# Altium schematic sheet Sheet.SchDoc
size A3
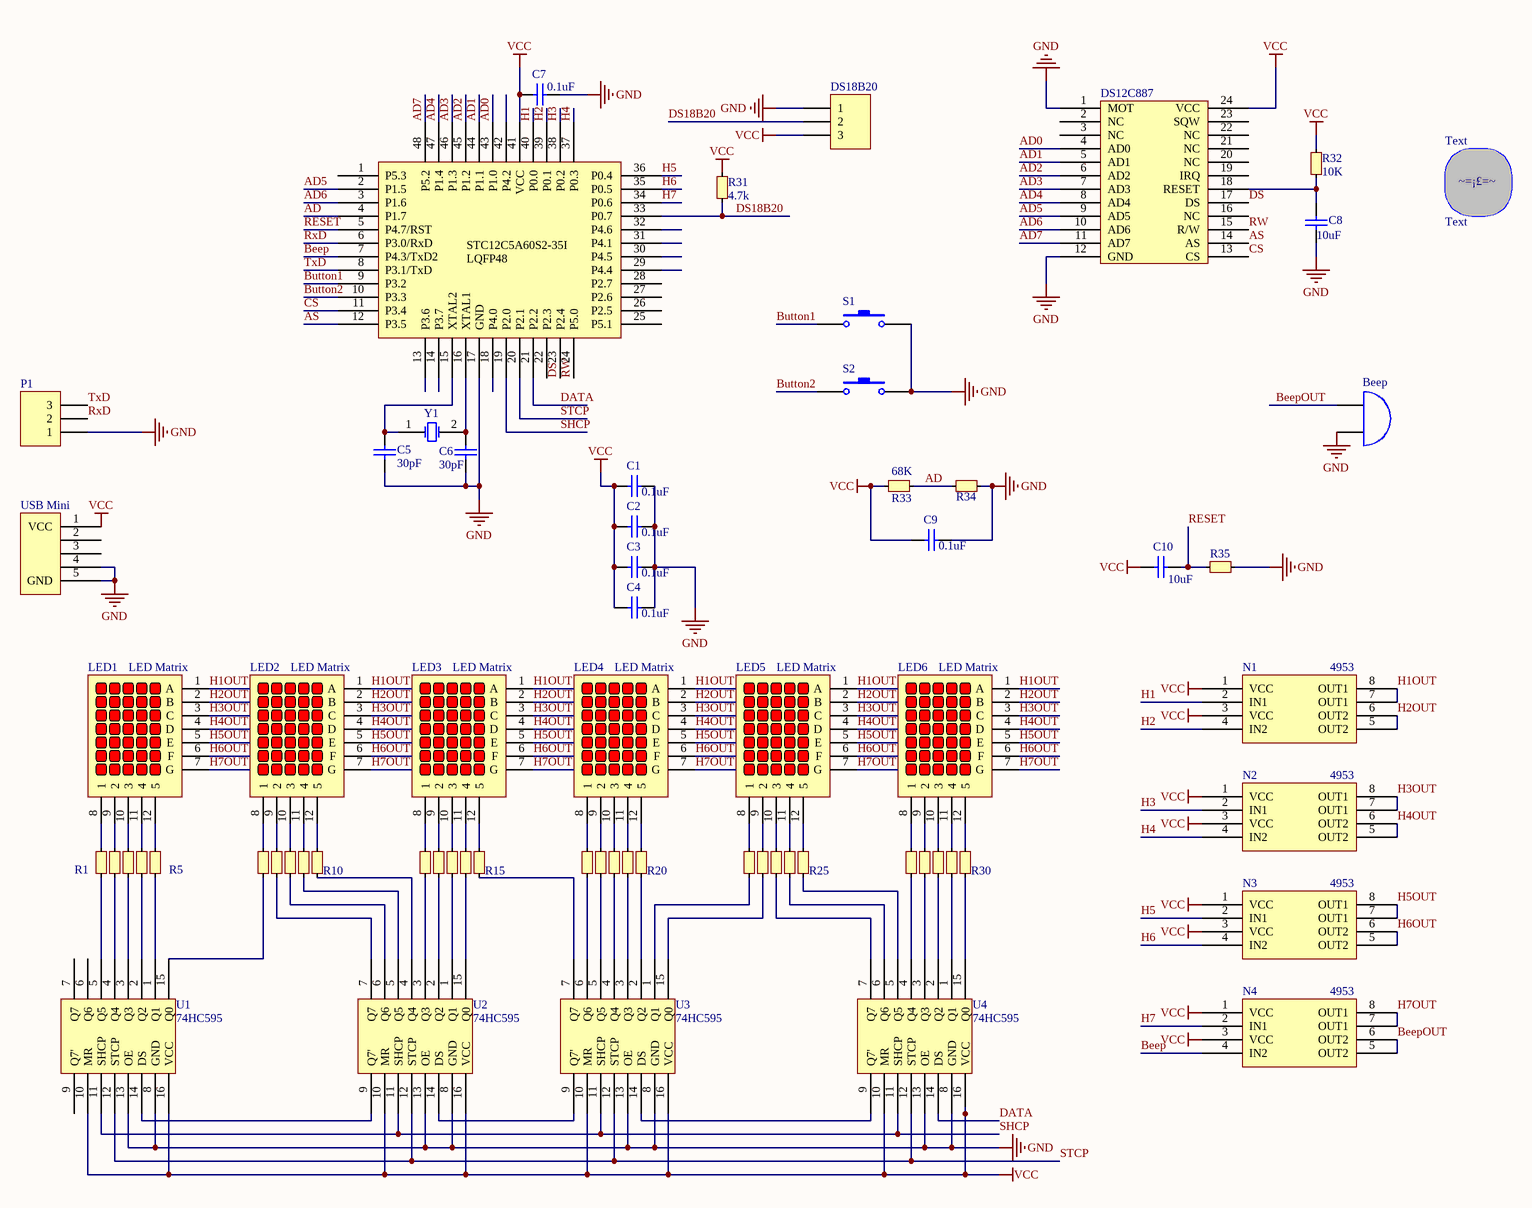
[diagram p0: Sheet.SchDoc]

## Parts
Beep  Bell  [Beep]  (value not drawn)
C1  value 0.1uF  [0805 - duplicate]  (hidden comment: Cap)
C2  value 0.1uF  [0805 - duplicate]  (hidden comment: Cap)
C3  value 0.1uF  [0805 - duplicate]  (hidden comment: Cap)
C4  value 0.1uF  [0805 - duplicate]  (hidden comment: Cap)
C5  value 30pF  [0805 - duplicate]  (hidden comment: Cap)
C6  value 30pF  [0805 - duplicate]  (hidden comment: Cap)
C7  value 0.1uF  [0805 - duplicate]  (hidden comment: Cap)
C8  value 10uF  [0805 - duplicate]  (hidden comment: Cap)
C9  value 0.1uF  [0805 - duplicate]  (hidden comment: Cap)
C10  value 10uF  [0805 - duplicate]  (hidden comment: Cap)
DS12C887  DS12C887  [Timer]  (value not drawn)
DS18B20  Header 3  [TO-92]  (value not drawn)
LED1  LED Matrix  [LED-Matrix 5*7]
LED2  LED Matrix  [LED-Matrix 5*7]
LED3  LED Matrix  [LED-Matrix 5*7]
LED4  LED Matrix  [LED-Matrix 5*7]
LED5  LED Matrix  [LED-Matrix 5*7]
LED6  LED Matrix  [LED-Matrix 5*7]
MCU  STC12C5A60S2-35I-LQFP48  [MCU]  (value not drawn)
N1  4953  [SO8_L]
N2  4953  [SO8_L]
N3  4953  [SO8_L]
N4  4953  [SO8_L]
P1  Header 3  [HDR1X3]  (value not drawn)
R1  Res  [0805]  (value not drawn)
R2  Res  [0805]  (value not drawn)
R3  Res  [0805]  (value not drawn)
R4  Res  [0805]  (value not drawn)
R5  Res  [0805]  (value not drawn)
R6  Res  [0805]  (value not drawn)
R7  Res  [0805]  (value not drawn)
R8  Res  [0805]  (value not drawn)
R9  Res  [0805]  (value not drawn)
R10  Res  [0805]  (value not drawn)
R11  Res  [0805]  (value not drawn)
R12  Res  [0805]  (value not drawn)
R13  Res  [0805]  (value not drawn)
R14  Res  [0805]  (value not drawn)
R15  Res  [0805]  (value not drawn)
R16  Res  [0805]  (value not drawn)
R17  Res  [0805]  (value not drawn)
R18  Res  [0805]  (value not drawn)
R19  Res  [0805]  (value not drawn)
R20  Res  [0805]  (value not drawn)
R21  Res  [0805]  (value not drawn)
R22  Res  [0805]  (value not drawn)
R23  Res  [0805]  (value not drawn)
R24  Res  [0805]  (value not drawn)
R25  Res  [0805]  (value not drawn)
R26  Res  [0805]  (value not drawn)
R27  Res  [0805]  (value not drawn)
R28  Res  [0805]  (value not drawn)
R29  Res  [0805]  (value not drawn)
R30  Res  [0805]  (value not drawn)
R31  4.7k  [0805]
R32  10K  [0805]
R33  68K  [0805]
R34  Res  [R38]  (value not drawn)
R35  Res  [0805]  (value not drawn)
S1  SW-PB  [Button]  (value not drawn)
S2  SW-PB  [Button]  (value not drawn)
Text  Text  [TUSIJI_8]
U1  74HC595  [SO-16_L]
U2  74HC595  [SO-16_L]
U3  74HC595  [SO-16_L]
U4  74HC595  [SO-16_L]
USB_Mini  (no value)  [Micro_USB]
Y1  XTAL  [5023]  (value not drawn)

## Nets
GND: Beep.2(B) C1.2 C2.2 C3.2 C4.2 C5.1 C6.1 C7.2 C8.1 C9.2 DS12C887.1(MOT) DS12C887.12(GND) DS18B20.1 MCU.17(GND) P1.1 R34.1 R35.1 S1.2 S2.2 U1.8(GND) U1.13(OE) U2.8(GND) U2.13(OE) U3.8(GND) U3.13(OE) U4.8(GND) U4.13(OE) USB_Mini.4 USB_Mini.5(GND)
VCC: C1.1 C2.1 C3.1 C4.1 C7.1 C9.1 C10.1 DS12C887.24(VCC) DS18B20.3 MCU.41(VCC) N1.1(VCC) N1.3(VCC) N2.1(VCC) N2.3(VCC) N3.1(VCC) N3.3(VCC) N4.1(VCC) N4.3(VCC) R31.1 R32.1 R33.0 U1.10(MR) U1.16(VCC) U2.10(MR) U2.16(VCC) U3.10(MR) U3.16(VCC) U4.10(MR) U4.16(VCC) USB_Mini.1(VCC)
AD: MCU.4(P1.7) R33.1 R34.0
AD0: DS12C887.4(AD0) MCU.43(P1.0)
AD1: DS12C887.5(AD1) MCU.44(P1.1)
AD2: DS12C887.6(AD2) MCU.45(P1.2)
AD3: DS12C887.7(AD3) MCU.46(P1.3)
AD4: DS12C887.8(AD4) MCU.47(P1.4)
AD5: DS12C887.9(AD5) MCU.2(P1.5)
AD6: DS12C887.10(AD6) MCU.3(P1.6)
AD7: DS12C887.11(AD7) MCU.48(P5.2)
AS: DS12C887.14(AS) MCU.12(P3.5)
Beep: MCU.7(P4.3/TxD2) N4.4(IN2)
BeepOUT: Beep.1(A) N4.5(OUT2) N4.6(OUT2)
Button1: MCU.9(P3.2) S1.1
Button2: MCU.10(P3.3) S2.1
CS: DS12C887.13(CS) MCU.11(P3.4)
DATA: MCU.21(P2.2) U4.14(DS)
DS: DS12C887.17(DS) MCU.23(P2.4)
DS18B20: DS18B20.2 MCU.33(P0.7) R31.0
H1: MCU.40(P0.0) N1.2(IN1)
H1OUT: LED1.1(A) LED2.1(A) LED3.1(A) LED4.1(A) LED5.1(A) LED6.1(A) N1.7(OUT1) N1.8(OUT1)
H2: MCU.39(P0.1) N1.4(IN2)
H2OUT: LED1.2(B) LED2.2(B) LED3.2(B) LED4.2(B) LED5.2(B) LED6.2(B) N1.5(OUT2) N1.6(OUT2)
H3: MCU.38(P0.2) N2.2(IN1)
H3OUT: LED1.3(C) LED2.3(C) LED3.3(C) LED4.3(C) LED5.3(C) LED6.3(C) N2.7(OUT1) N2.8(OUT1)
H4: MCU.37(P0.3) N2.4(IN2)
H4OUT: LED1.4(D) LED2.4(D) LED3.4(D) LED4.4(D) LED5.4(D) LED6.4(D) N2.5(OUT2) N2.6(OUT2)
H5: MCU.36(P0.4) N3.2(IN1)
H5OUT: LED1.5(E) LED2.5(E) LED3.5(E) LED4.5(E) LED5.5(E) LED6.5(E) N3.7(OUT1) N3.8(OUT1)
H6: MCU.35(P0.5) N3.4(IN2)
H6OUT: LED1.6(F) LED2.6(F) LED3.6(F) LED4.6(F) LED5.6(F) LED6.6(F) N3.5(OUT2) N3.6(OUT2)
H7: MCU.34(P0.6) N4.2(IN1)
H7OUT: LED1.7(G) LED2.7(G) LED3.7(G) LED4.7(G) LED5.7(G) LED6.7(G) N4.7(OUT1) N4.8(OUT1)
RESET: C10.2 MCU.5(P4.7/RST) R35.0
RW: DS12C887.15(R/W) MCU.24(P5.0)
RxD: MCU.6(P3.0/RxD) P1.2
SHCP: MCU.19(P2.0) U1.11(SHCP) U2.11(SHCP) U3.11(SHCP) U4.11(SHCP)
STCP: MCU.20(P2.1) U1.12(STCP) U2.12(STCP) U3.12(STCP) U4.12(STCP)
TxD: MCU.8(P3.1/TxD) P1.3
NetC5_2: C5.2 MCU.15(XTAL2) Y1.1(OSC1)
NetC6_2: C6.2 MCU.16(XTAL1) Y1.2(OSC2)
NetC8_2: C8.2 DS12C887.18(RESET) R32.0
NetLED1_8: LED1.8(1) R1.1
NetLED1_9: LED1.9(2) R2.1
NetLED1_10: LED1.10(3) R3.1
NetLED1_11: LED1.11(4) R4.1
NetLED1_12: LED1.12(5) R5.1
NetLED2_8: LED2.8(1) R6.1
NetLED2_9: LED2.9(2) R7.1
NetLED2_10: LED2.10(3) R8.1
NetLED2_11: LED2.11(4) R9.1
NetLED2_12: LED2.12(5) R10.1
NetLED3_8: LED3.8(1) R11.1
NetLED3_9: LED3.9(2) R12.1
NetLED3_10: LED3.10(3) R13.1
NetLED3_11: LED3.11(4) R14.1
NetLED3_12: LED3.12(5) R15.1
NetLED4_8: LED4.8(1) R16.1
NetLED4_9: LED4.9(2) R17.1
NetLED4_10: LED4.10(3) R18.1
NetLED4_11: LED4.11(4) R19.1
NetLED4_12: LED4.12(5) R20.1
NetLED5_8: LED5.8(1) R21.1
NetLED5_9: LED5.9(2) R22.1
NetLED5_10: LED5.10(3) R23.1
NetLED5_11: LED5.11(4) R24.1
NetLED5_12: LED5.12(5) R25.1
NetLED6_8: LED6.8(1) R26.1
NetLED6_9: LED6.9(2) R27.1
NetLED6_10: LED6.10(3) R28.1
NetLED6_11: LED6.11(4) R29.1
NetLED6_12: LED6.12(5) R30.1
NetR1_0: R1.0 U1.5(Q5)
NetR2_0: R2.0 U1.4(Q4)
NetR3_0: R3.0 U1.3(Q3)
NetR4_0: R4.0 U1.2(Q2)
NetR5_0: R5.0 U1.1(Q1)
NetR6_0: R6.0 U1.15(Q0)
NetR7_0: R7.0 U2.7(Q7)
NetR8_0: R8.0 U2.6(Q6)
NetR9_0: R9.0 U2.5(Q5)
NetR10_0: R10.0 U2.4(Q4)
NetR11_0: R11.0 U2.3(Q3)
NetR12_0: R12.0 U2.2(Q2)
NetR13_0: R13.0 U2.1(Q1)
NetR14_0: R14.0 U2.15(Q0)
NetR15_0: R15.0 U3.7(Q7)
NetR16_0: R16.0 U3.6(Q6)
NetR17_0: R17.0 U3.5(Q5)
NetR18_0: R18.0 U3.4(Q4)
NetR19_0: R19.0 U3.3(Q3)
NetR20_0: R20.0 U3.2(Q2)
NetR21_0: R21.0 U3.1(Q1)
NetR22_0: R22.0 U3.15(Q0)
NetR23_0: R23.0 U4.7(Q7)
NetR24_0: R24.0 U4.6(Q6)
NetR25_0: R25.0 U4.5(Q5)
NetR26_0: R26.0 U4.4(Q4)
NetR27_0: R27.0 U4.3(Q3)
NetR28_0: R28.0 U4.2(Q2)
NetR29_0: R29.0 U4.1(Q1)
NetR30_0: R30.0 U4.15(Q0)
NetU1_14: U1.14(DS) U2.9(Q7')
NetU2_14: U2.14(DS) U3.9(Q7')
NetU3_14: U3.14(DS) U4.9(Q7')

Not connected (* = marked no-connect by the designer): DS12C887 2(NC) 3(NC) 16(NC) 19(IRQ) 20(NC) 21(NC) 22(NC) 23(SQW); MCU 1(P5.3) 13(P3.6) 14(P3.7) 18(P4.0) 22(P2.3) 25(P5.1) 26(P2.5) 27(P2.6) 28(P2.7) 29(P4.4) 30(P4.5) 31(P4.1) 32(P4.6) 42(P4.2); U1 6(Q6) 7(Q7) 9(Q7'); USB_Mini 2 3

## Notes on the sheet
- Title
- Size:
- Date:
- A3
- Number:
- Time:
- Revision:
- Sheet
- of
- File:
- (in symbol STC12C5A60S2-35I-LQFP48) STC12C5A60S2-35I / LQFP48
- (in symbol Text) ~=¡£=~

## Library data of the parts
Beep = Bell: Electrical Bell; pin to pad: 1>0 2>1; Published: 24-Mar-1999; LatestRevisionDate: 17-Jul-2002; LatestRevisionNote: Re-released for DXP Platform.; PackageReference: PIN2; Publisher: Altium Limited
C1-C10 = Cap: Capacitor; Published: 8-Jun-2000; LatestRevisionDate: 17-Jul-2002; LatestRevisionNote: Re-released for DXP Platform.; PackageReference: RAD-0.3; Publisher: Altium Limited; PackageDescription: Radial Cap, Thru-Hole; 2 Leads; 0.3 in Pin Spacing
DS18B20 P1 = Header 3: Header, 3-Pin; LatestRevisionDate: 17-Jul-2002; LatestRevisionNote: Re-released for DXP Platform.; Publisher: Altium Limited
LED1-LED6 = LED-Matrix 5*7: MinimumIntensity: 360 ucd; Note: IF = 5 mA; Colour: High Efficiency Red (HER); Note: Pins 1 and 6 are redundant Anodes.; Published: 8-Jun-2000; LatestRevisionDate: 17-Dec-2003; LatestRevisionNote: Schematic revised, PCB Footprint replaced.; DatasheetDocument: 19-Feb-2002; PackageDocument: 19-Feb-2002; PackageReference: LEDDIP-10; Publisher: Altium Limited; ComponentLink1Description: Manufacturer Link; ComponentLink1URL: http://www.agilent.com/
R31-R33 = Res
R34 = Res: pin to pad: 0>1 1>2
S1 S2 = SW-PB: Switch; pin to pad: 1>0 2>1; Published: 24-Mar-1999; LatestRevisionDate: 17-Jul-2002; LatestRevisionNote: Re-released for DXP Platform.; PackageReference: SPST-2; Publisher: Altium Limited; PackageDescription: Switch; 2 Leads
USB_Mini = USB
Y1 = XTAL: Crystal Oscillator; Published: 8-Jun-2000; LatestRevisionDate: 17-Jul-2002; LatestRevisionNote: Re-released for DXP Platform.; PackageReference: R38; Publisher: Altium Limited; PackageDescription: Crystal, Thru-Hole; 2 Leads; Body 3.1 x 8.2 mm (Dia.xH)